# EAGLE design eCog0_Blank_Alt1 (EAGLE 6.6.0)
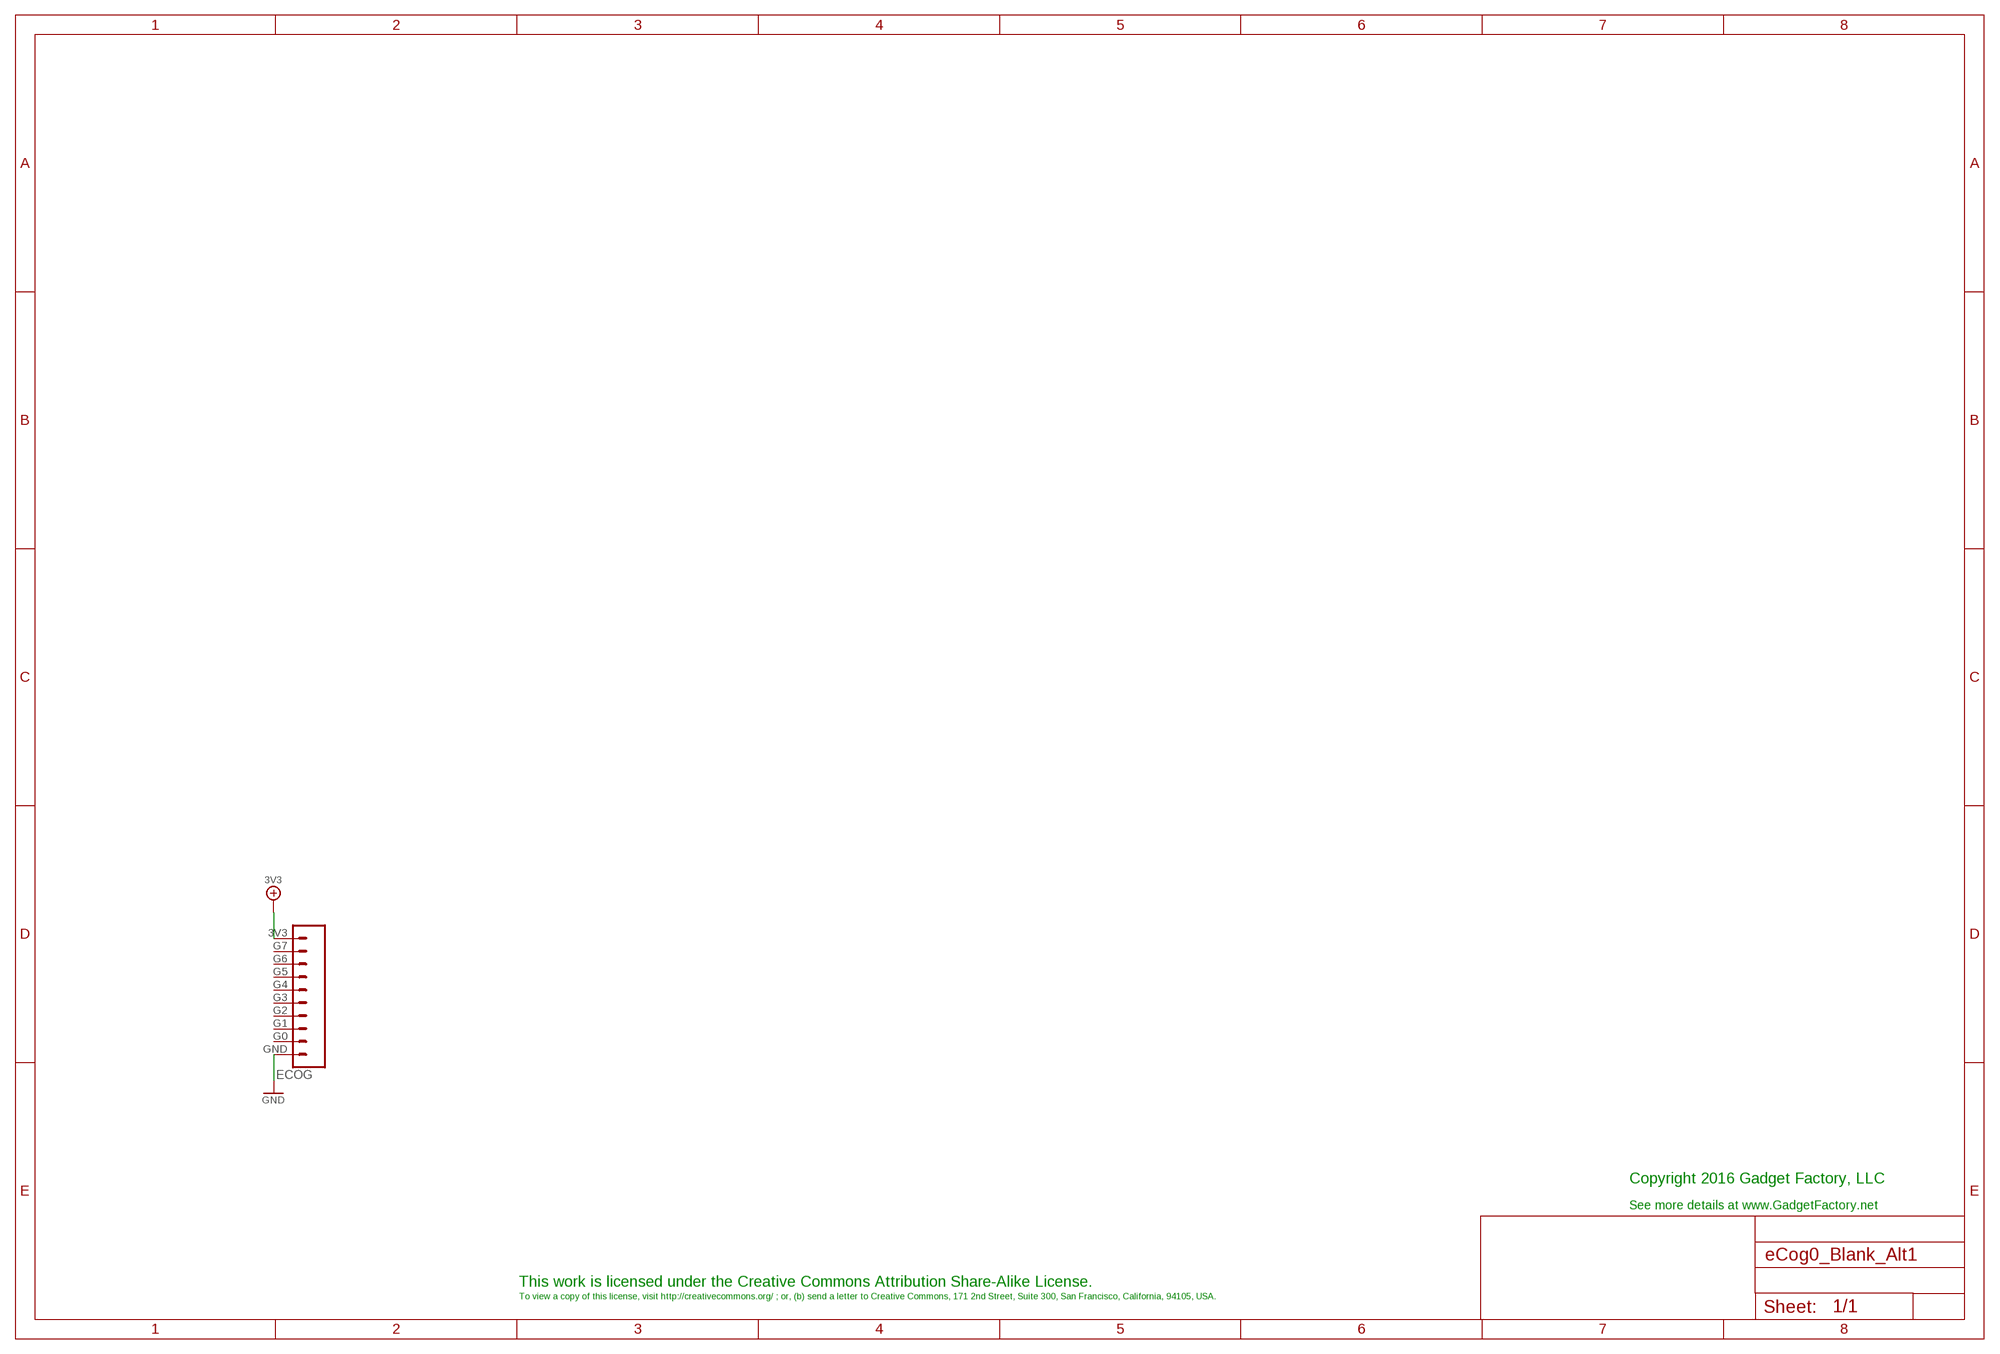
[diagram p0: schematic, sheet 1]

## Parts
ECOG  ECOG_GENERAL_ROWECOG_GENERAL_SMD  [ECOG_GENERAL_SMD]

## Nets
3V3: ECOG.3V3
GND: ECOG.GND
Unconnected: ECOG.G0 ECOG.G1 ECOG.G2 ECOG.G3 ECOG.G4 ECOG.G5 ECOG.G6 ECOG.G7

## Notes on the sheet
- Copyright 2016 Gadget Factory, LLC
- See more details at www.GadgetFactory.net
- This work is licensed under the Creative Commons Attribution Share-Alike License.
- To view a copy of this license, visit http://creativecommons.org/ ; or, (b) send a letter to Creative Commons, 171 2nd Street, Suite 300, San Francisco, California, 94105, USA.

## Library data of the parts
ECOG = eCogs:ECOG_GENERAL_ROW; DIGIKEY: S1013EC-10-ND

## Board
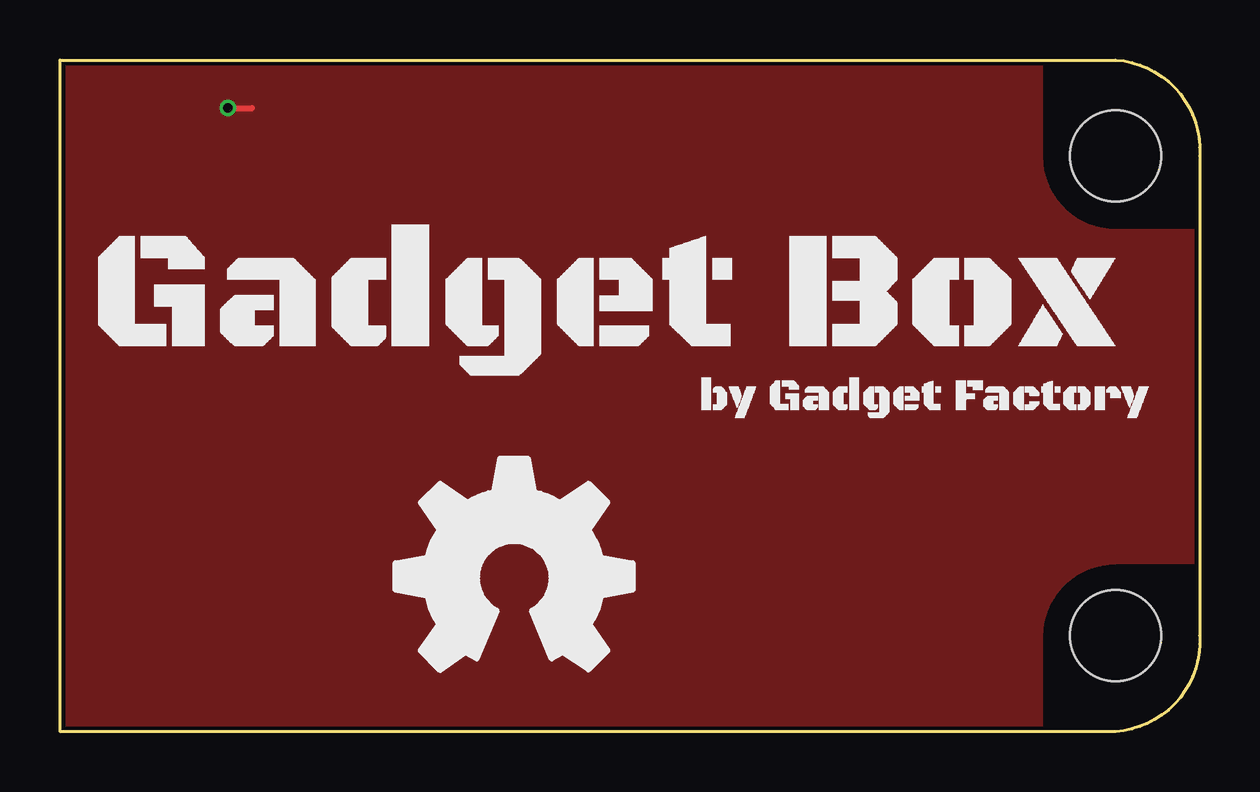
[diagram p1: board, top side]
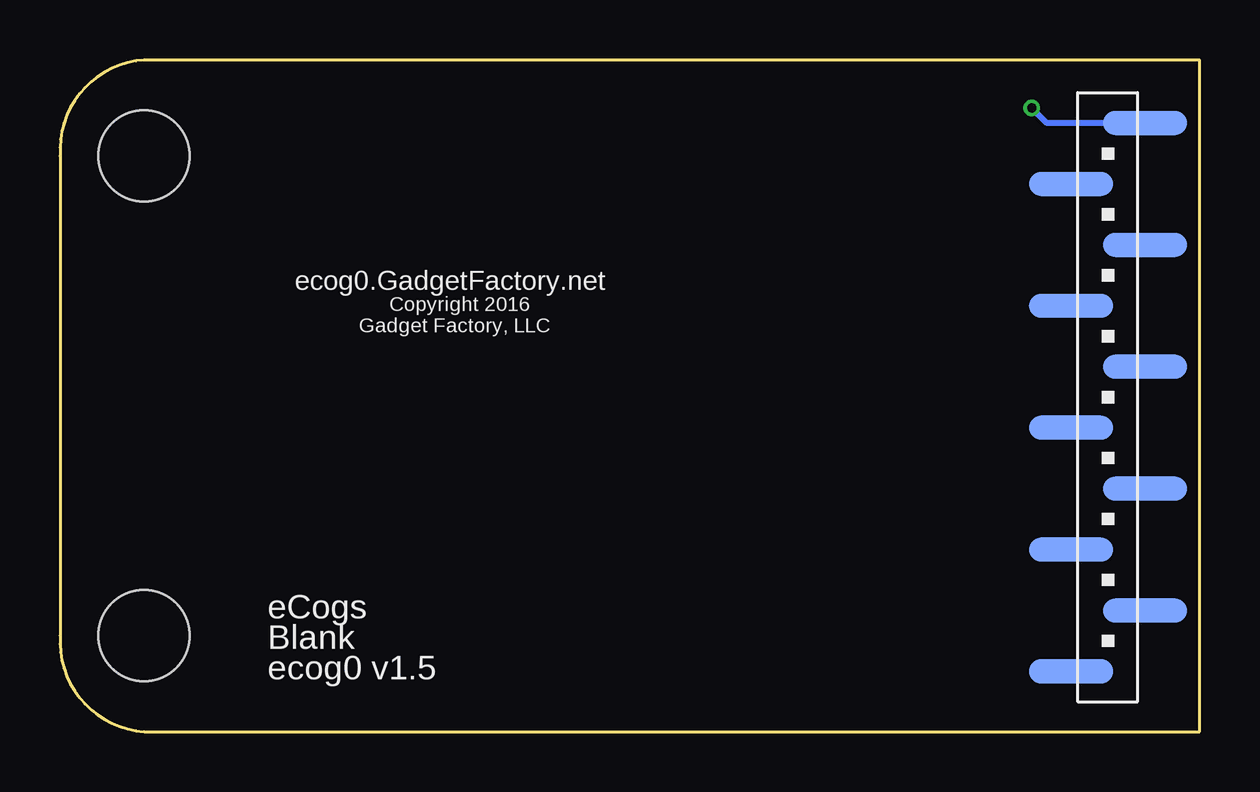
[diagram p2: board, bottom side, seen from below]

Size 47.51 x 28 mm. Coordinates in mm from the lower left corner, seen from the top.
Copper layers (1*16): Top 0.035mm / dielectric 1.5mm / Bottom 0.035mm
Design rules "hackvana *": minimum track width 6mil, minimum drill 0.3mm, track to track 6mil, track to pad 6mil, pad to pad 6mil, via to via 6mil, smd to smd 0mil, copper to edge 6mil, drill to drill 6mil, minimum pad ring 10mil, minimum via ring 6mil, stop-mask expansion 2mil, vias tented up to drill 100mil, thermal gap 10mil

### Footprints (pad centres in the part's own frame; a part is rotated, then mirrored left to right if it is on the bottom)
ECOG_GENERAL_SMD = smd 3.5 x 1 bottom: 3V3 5.369,2.51; G0 5.369,22.83; G1 2.271,20.29; G2 5.369,17.75; G3 2.271,15.21; G4 5.369,12.67; G5 2.271,10.13; G6 5.369,7.59; G7 2.271,5.05; GND 2.271,25.37 | hole 3.8: 44,4; 44,24

### Placement (x,y rotation side)
ECOG  0,0 0 top
U$1  [OSHW_FILLX350_NOTEXT]  13.97,2.54 0 top
U$2  [GADGETBOX_TEXT]  22.86,17.78 0 top

### Tracks (layer width: path | path; a pad name or v marks a point on that pad's centre or on a via)
GND  (via drill 0.38)
  Top 0.254: v7,26 8,26
  Bottom 0.254: ECOG.GND 6.37,25.37 v7,26
  pour Top: -1,29 49,29 49,-1 -1,-1

### Text on the board
bPlace: Copyright 2016 | ecog0.GadgetFactory.net | Gadget Factory, LLC | eCogs | Blank | ecog0 v1.5